# EAGLE schematic FbLike (EAGLE 7.2.0)
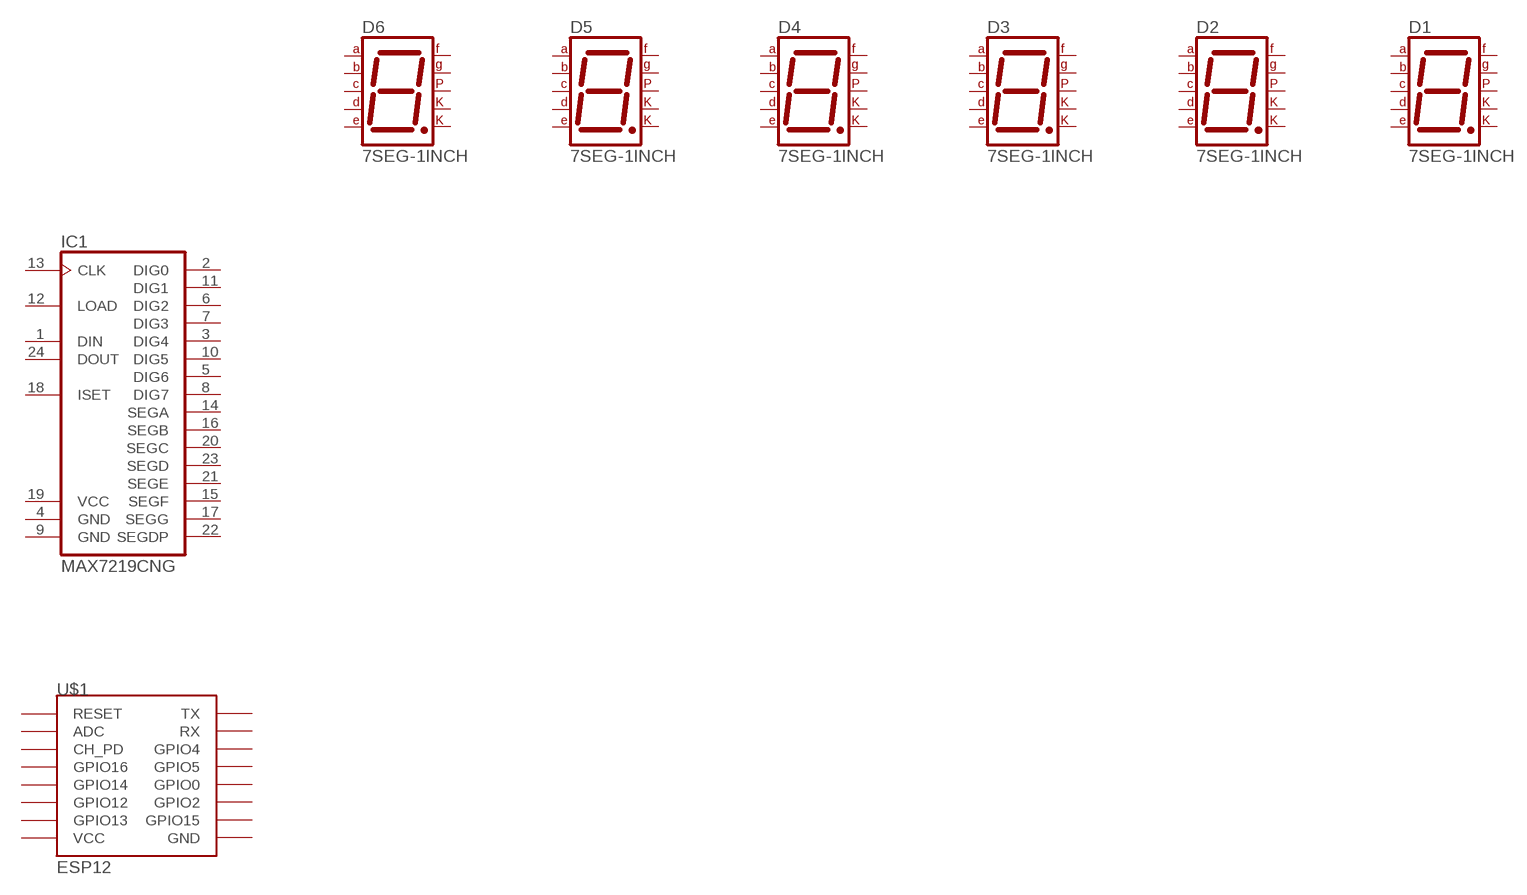
[diagram p0: schematic, sheet 1]

## Parts
D1  7SEG-1INCH  [7SEG-1INCH]
D2  7SEG-1INCH  [7SEG-1INCH]
D3  7SEG-1INCH  [7SEG-1INCH]
D4  7SEG-1INCH  [7SEG-1INCH]
D5  7SEG-1INCH  [7SEG-1INCH]
D6  7SEG-1INCH  [7SEG-1INCH]
IC1  MAX7219CNG  [DIL24-3]
U$1  ESP12  [ESP12]
Unconnected: D1.1(E) D1.2(D) D1.3(CK2) D1.4(C) D1.5(DP) D1.6(B) D1.7(A) D1.8(CK1) D1.9(F) D1.10(G) D2.1(E) D2.2(D) D2.3(CK2) D2.4(C) D2.5(DP) D2.6(B) D2.7(A) D2.8(CK1) D2.9(F) D2.10(G) D3.1(E) D3.2(D) D3.3(CK2) D3.4(C) D3.5(DP) D3.6(B) D3.7(A) D3.8(CK1) D3.9(F) D3.10(G) D4.1(E) D4.2(D) D4.3(CK2) D4.4(C) D4.5(DP) D4.6(B) D4.7(A) D4.8(CK1) D4.9(F) D4.10(G) D5.1(E) D5.2(D) D5.3(CK2) D5.4(C) D5.5(DP) D5.6(B) D5.7(A) D5.8(CK1) D5.9(F) D5.10(G) D6.1(E) D6.2(D) D6.3(CK2) D6.4(C) D6.5(DP) D6.6(B) D6.7(A) D6.8(CK1) D6.9(F) D6.10(G) IC1.1(DIN) IC1.2(DIG0) IC1.3(DIG4) IC1.5(DIG6) IC1.6(DIG2) IC1.7(DIG3) IC1.8(DIG7) IC1.10(DIG5) IC1.11(DIG1) IC1.12(LOAD) IC1.13(CLK) IC1.14(SEGA) IC1.15(SEGF) IC1.16(SEGB) IC1.17(SEGG) IC1.18(ISET) IC1.20(SEGC) IC1.21(SEGE) IC1.22(SEGDP) IC1.23(SEGD) IC1.24(DOUT) U$1.ADC U$1.CH_PD U$1.GND U$1.GPIO0 U$1.GPIO2 U$1.GPIO4 U$1.GPIO5 U$1.GPIO12 U$1.GPIO13 U$1.GPIO14 U$1.GPIO15 U$1.GPIO16 U$1.RESET U$1.RX U$1.TX U$1.VCC

## Power pins joined to a net without a drawn wire
GND: IC1.4(GND) IC1.9(GND)
VCC: IC1.19(VCC)

## Library data of the parts
D1-D6 = My7Segment:7SEG-1INCH: 7-segment DISPLAY single cathode, 1 Inch
IC1 = maxim:MAX7219CNG: LED DISPLAY DRIVER; MF: MAXIM; MPN: MAX7219CNG; OC_FARNELL: 1523914; OC_NEWARK: 34C4018
U$1 = esp8266modules:ESP12: ESP8266 Wifi module 12